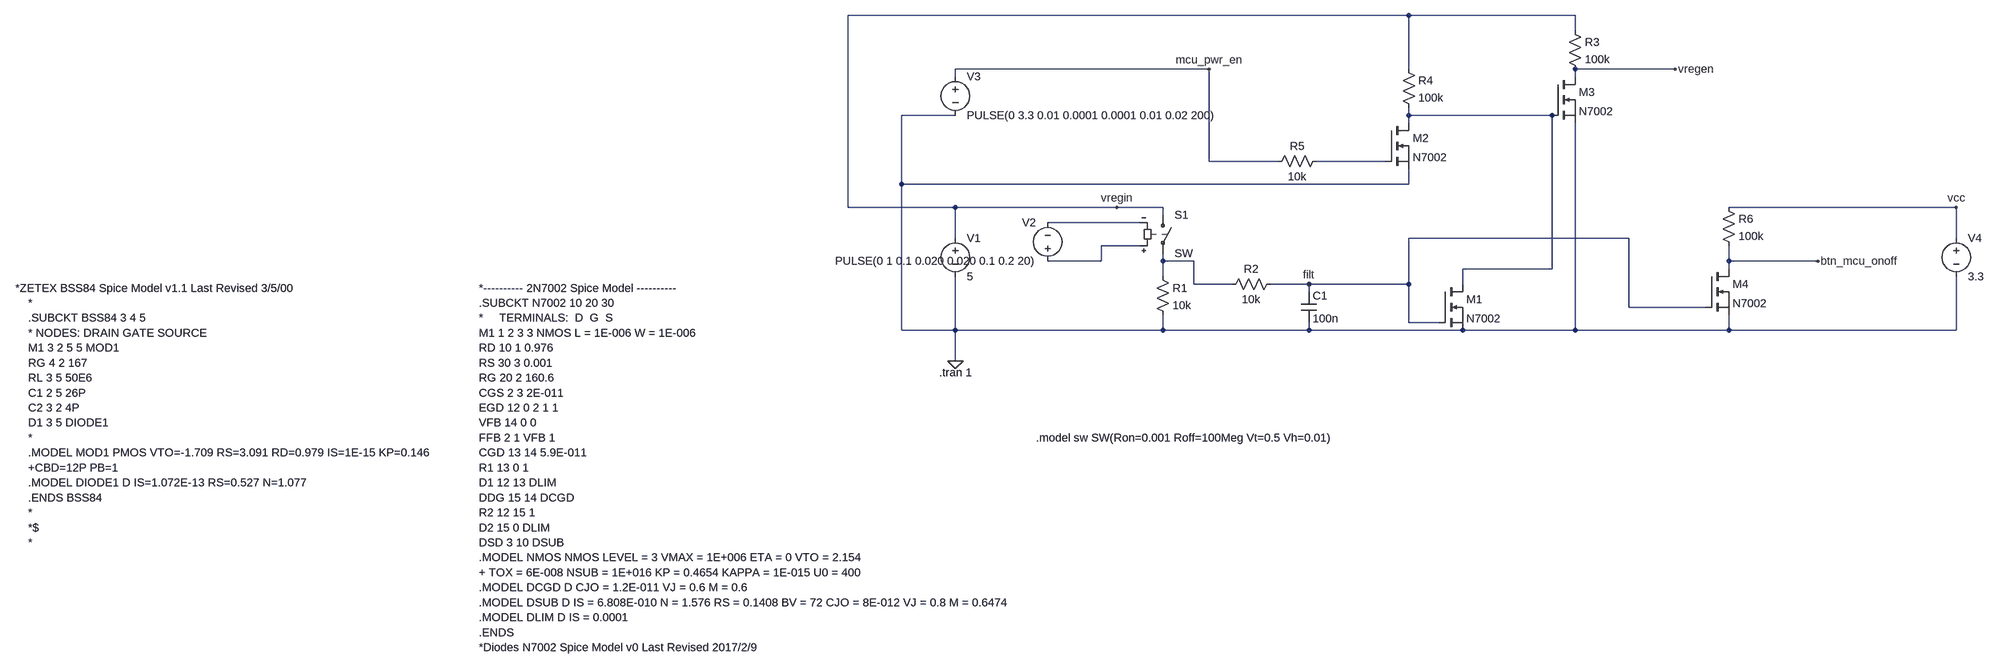
[diagram p0: schematic pwrbtn.asc]
pwrbtn.asc, the LTspice schematic file:
Version 4
SHEET 1 2240 744
WIRE 1008 -512 -160 -512
WIRE 1376 -512 1008 -512
WIRE 1376 -480 1376 -512
WIRE 592 -400 64 -400
WIRE 1008 -400 1008 -512
WIRE 1584 -400 1376 -400
WIRE 64 -384 64 -400
WIRE 1376 -384 1376 -400
WIRE 64 -304 -48 -304
WIRE 1008 -304 1008 -320
WIRE 1328 -304 1008 -304
WIRE 1008 -288 1008 -304
WIRE 592 -208 592 -400
WIRE 736 -208 592 -208
WIRE 960 -208 816 -208
WIRE -48 -160 -48 -304
WIRE 1008 -160 1008 -192
WIRE 1008 -160 -48 -160
WIRE -160 -112 -160 -512
WIRE 64 -112 -160 -112
WIRE 400 -112 64 -112
WIRE 496 -112 400 -112
WIRE 2176 -112 1696 -112
WIRE 496 -96 496 -112
WIRE 448 -80 256 -80
WIRE 64 -48 64 -112
WIRE 1488 -48 1008 -48
WIRE 2176 -48 2176 -112
WIRE 448 -32 368 -32
WIRE 368 0 368 -32
WIRE 368 0 256 0
WIRE 496 0 496 -16
WIRE 560 0 496 0
WIRE 1696 0 1696 -32
WIRE 1888 0 1696 0
WIRE 1328 16 1328 -304
WIRE 1328 16 1120 16
WIRE 1696 16 1696 0
WIRE 496 32 496 0
WIRE 560 48 560 0
WIRE 640 48 560 48
WIRE 800 48 720 48
WIRE 1008 48 1008 -48
WIRE 1008 48 800 48
WIRE 1120 48 1120 16
WIRE 800 64 800 48
WIRE 1488 96 1488 -48
WIRE 1648 96 1488 96
WIRE 1008 128 1008 48
WIRE 1072 128 1008 128
WIRE -48 144 -48 -160
WIRE 64 144 64 32
WIRE 64 144 -48 144
WIRE 496 144 496 112
WIRE 496 144 64 144
WIRE 800 144 800 128
WIRE 800 144 496 144
WIRE 1120 144 800 144
WIRE 1376 144 1376 -288
WIRE 1376 144 1120 144
WIRE 1696 144 1696 112
WIRE 1696 144 1376 144
WIRE 2176 144 2176 32
WIRE 2176 144 1696 144
WIRE 64 208 64 144
FLAG 64 208 0
FLAG 800 48 filt
FLAG 400 -112 vregin
FLAG 1584 -400 vregen
FLAG 592 -400 mcu_pwr_en
FLAG 1888 0 btn_mcu_onoff
FLAG 2176 -112 vcc
SYMBOL res 480 16 R0
SYMATTR InstName R1
SYMATTR Value 10k
SYMBOL res 736 32 R90
WINDOW 0 0 56 VBottom 2
WINDOW 3 32 56 VTop 2
SYMATTR InstName R2
SYMATTR Value 10k
SYMBOL cap 784 64 R0
SYMATTR InstName C1
SYMATTR Value 100n
SYMBOL sw 496 -112 R0
SYMATTR InstName S1
SYMBOL voltage 64 -64 R0
WINDOW 123 0 0 Left 0
WINDOW 39 0 0 Left 0
SYMATTR InstName V1
SYMATTR Value 5
SYMBOL voltage 256 16 R180
WINDOW 0 24 96 Left 2
WINDOW 3 24 16 Left 2
WINDOW 123 0 0 Left 0
WINDOW 39 0 0 Left 0
SYMATTR InstName V2
SYMATTR Value PULSE(0 1 0.1 0.020 0.020 0.1 0.2 20)
SYMBOL nmos 1072 48 R0
SYMATTR InstName M1
SYMATTR Value N7002
SYMATTR Prefix X
SYMBOL voltage 64 -400 R0
WINDOW 123 0 0 Left 0
WINDOW 39 0 0 Left 0
SYMATTR InstName V3
SYMATTR Value PULSE(0 3.3 0.01 0.0001 0.0001 0.01 0.02 200)
SYMBOL nmos 960 -288 R0
SYMATTR InstName M2
SYMATTR Value N7002
SYMATTR Prefix X
SYMBOL res 992 -416 R0
SYMATTR InstName R4
SYMATTR Value 100k
SYMBOL res 832 -224 R90
WINDOW 0 0 56 VBottom 2
WINDOW 3 32 56 VTop 2
SYMATTR InstName R5
SYMATTR Value 10k
SYMBOL nmos 1328 -384 R0
SYMATTR InstName M3
SYMATTR Value N7002
SYMATTR Prefix X
SYMBOL res 1360 -496 R0
SYMATTR InstName R3
SYMATTR Value 100k
SYMBOL nmos 1648 16 R0
SYMATTR InstName M4
SYMATTR Value N7002
SYMATTR Prefix X
SYMBOL res 1680 -128 R0
SYMATTR InstName R6
SYMATTR Value 100k
SYMBOL voltage 2176 -64 R0
WINDOW 123 0 0 Left 0
WINDOW 39 0 0 Left 0
SYMATTR InstName V4
SYMATTR Value 3.3
TEXT 30 232 Left 2 !.tran 1
TEXT 232 368 Left 2 !.model sw SW(Ron=0.001 Roff=100Meg Vt=0.5 Vh=0.01)
TEXT -928 56 Left 2 !*---------- 2N7002 Spice Model ----------\n.SUBCKT N7002 10 20 30 \n*     TERMINALS:  D  G  S\nM1 1 2 3 3 NMOS L = 1E-006 W = 1E-006 \nRD 10 1 0.976 \nRS 30 3 0.001 \nRG 20 2 160.6 \nCGS 2 3 2E-011 \nEGD 12 0 2 1 1 \nVFB 14 0 0 \nFFB 2 1 VFB 1 \nCGD 13 14 5.9E-011 \nR1 13 0 1 \nD1 12 13 DLIM \nDDG 15 14 DCGD \nR2 12 15 1 \nD2 15 0 DLIM \nDSD 3 10 DSUB \n.MODEL NMOS NMOS LEVEL = 3 VMAX = 1E+006 ETA = 0 VTO = 2.154 \n+ TOX = 6E-008 NSUB = 1E+016 KP = 0.4654 KAPPA = 1E-015 U0 = 400 \n.MODEL DCGD D CJO = 1.2E-011 VJ = 0.6 M = 0.6 \n.MODEL DSUB D IS = 6.808E-010 N = 1.576 RS = 0.1408 BV = 72 CJO = 8E-012 VJ = 0.8 M = 0.6474 \n.MODEL DLIM D IS = 0.0001 \n.ENDS\n*Diodes N7002 Spice Model v0 Last Revised 2017/2/9
TEXT -1928 56 Left 2 !*ZETEX BSS84 Spice Model v1.1 Last Revised 3/5/00\n    *              \n    .SUBCKT BSS84 3 4 5\n    * NODES: DRAIN GATE SOURCE\n    M1 3 2 5 5 MOD1\n    RG 4 2 167\n    RL 3 5 50E6\n    C1 2 5 26P\n    C2 3 2 4P \n    D1 3 5 DIODE1\n    *\n    .MODEL MOD1 PMOS VTO=-1.709 RS=3.091 RD=0.979 IS=1E-15 KP=0.146\n    +CBD=12P PB=1\n    .MODEL DIODE1 D IS=1.072E-13 RS=0.527 N=1.077\n    .ENDS BSS84\n    *\n    *$\n    *

The netlist it stands for:
* pwrbtn.asc
R1 N005 0 10k
R2 filt N005 10k
C1 filt 0 100n
S1 vregin N005 N004 N003 SW
V1 vregin 0 5
V2 N004 N003 PULSE(0 1 0.1 0.020 0.020 0.1 0.2 20)
XM1 N001 filt 0 N7002  ; pins D G S
V3 mcu_pwr_en 0 PULSE(0 3.3 0.01 0.0001 0.0001 0.01 0.02 200)
XM2 N001 N002 0 N7002  ; pins D G S
R4 vregin N001 100k
R5 N002 mcu_pwr_en 10k
XM3 vregen N001 0 N7002  ; pins D G S
R3 vregin vregen 100k
XM4 btn_mcu_onoff filt 0 N7002  ; pins D G S
R6 vcc btn_mcu_onoff 100k
V4 vcc 0 3.3
.tran 1
.model sw SW(Ron=0.001 Roff=100Meg Vt=0.5 Vh=0.01)
*---------- 2N7002 Spice Model ----------
.SUBCKT N7002 10 20 30
*     TERMINALS:  D  G  S
M1 1 2 3 3 NMOS L = 1E-006 W = 1E-006
RD 10 1 0.976
RS 30 3 0.001
RG 20 2 160.6
CGS 2 3 2E-011
EGD 12 0 2 1 1
VFB 14 0 0
FFB 2 1 VFB 1
CGD 13 14 5.9E-011
R1 13 0 1
D1 12 13 DLIM
DDG 15 14 DCGD
R2 12 15 1
D2 15 0 DLIM
DSD 3 10 DSUB
.MODEL NMOS NMOS LEVEL = 3 VMAX = 1E+006 ETA = 0 VTO = 2.154
+ TOX = 6E-008 NSUB = 1E+016 KP = 0.4654 KAPPA = 1E-015 U0 = 400
.MODEL DCGD D CJO = 1.2E-011 VJ = 0.6 M = 0.6
.MODEL DSUB D IS = 6.808E-010 N = 1.576 RS = 0.1408 BV = 72 CJO = 8E-012 VJ = 0.8 M = 0.6474
.MODEL DLIM D IS = 0.0001
.ENDS
*Diodes N7002 Spice Model v0 Last Revised 2017/2/9
*ZETEX BSS84 Spice Model v1.1 Last Revised 3/5/00
    *
    .SUBCKT BSS84 3 4 5
    * NODES: DRAIN GATE SOURCE
    M1 3 2 5 5 MOD1
    RG 4 2 167
    RL 3 5 50E6
    C1 2 5 26P
    C2 3 2 4P
    D1 3 5 DIODE1
    *
    .MODEL MOD1 PMOS VTO=-1.709 RS=3.091 RD=0.979 IS=1E-15 KP=0.146
    +CBD=12P PB=1
    .MODEL DIODE1 D IS=1.072E-13 RS=0.527 N=1.077
    .ENDS BSS84
    *
    *$
    *
.backanno
.end